# EAGLE schematic mainboard (EAGLE 6.4)
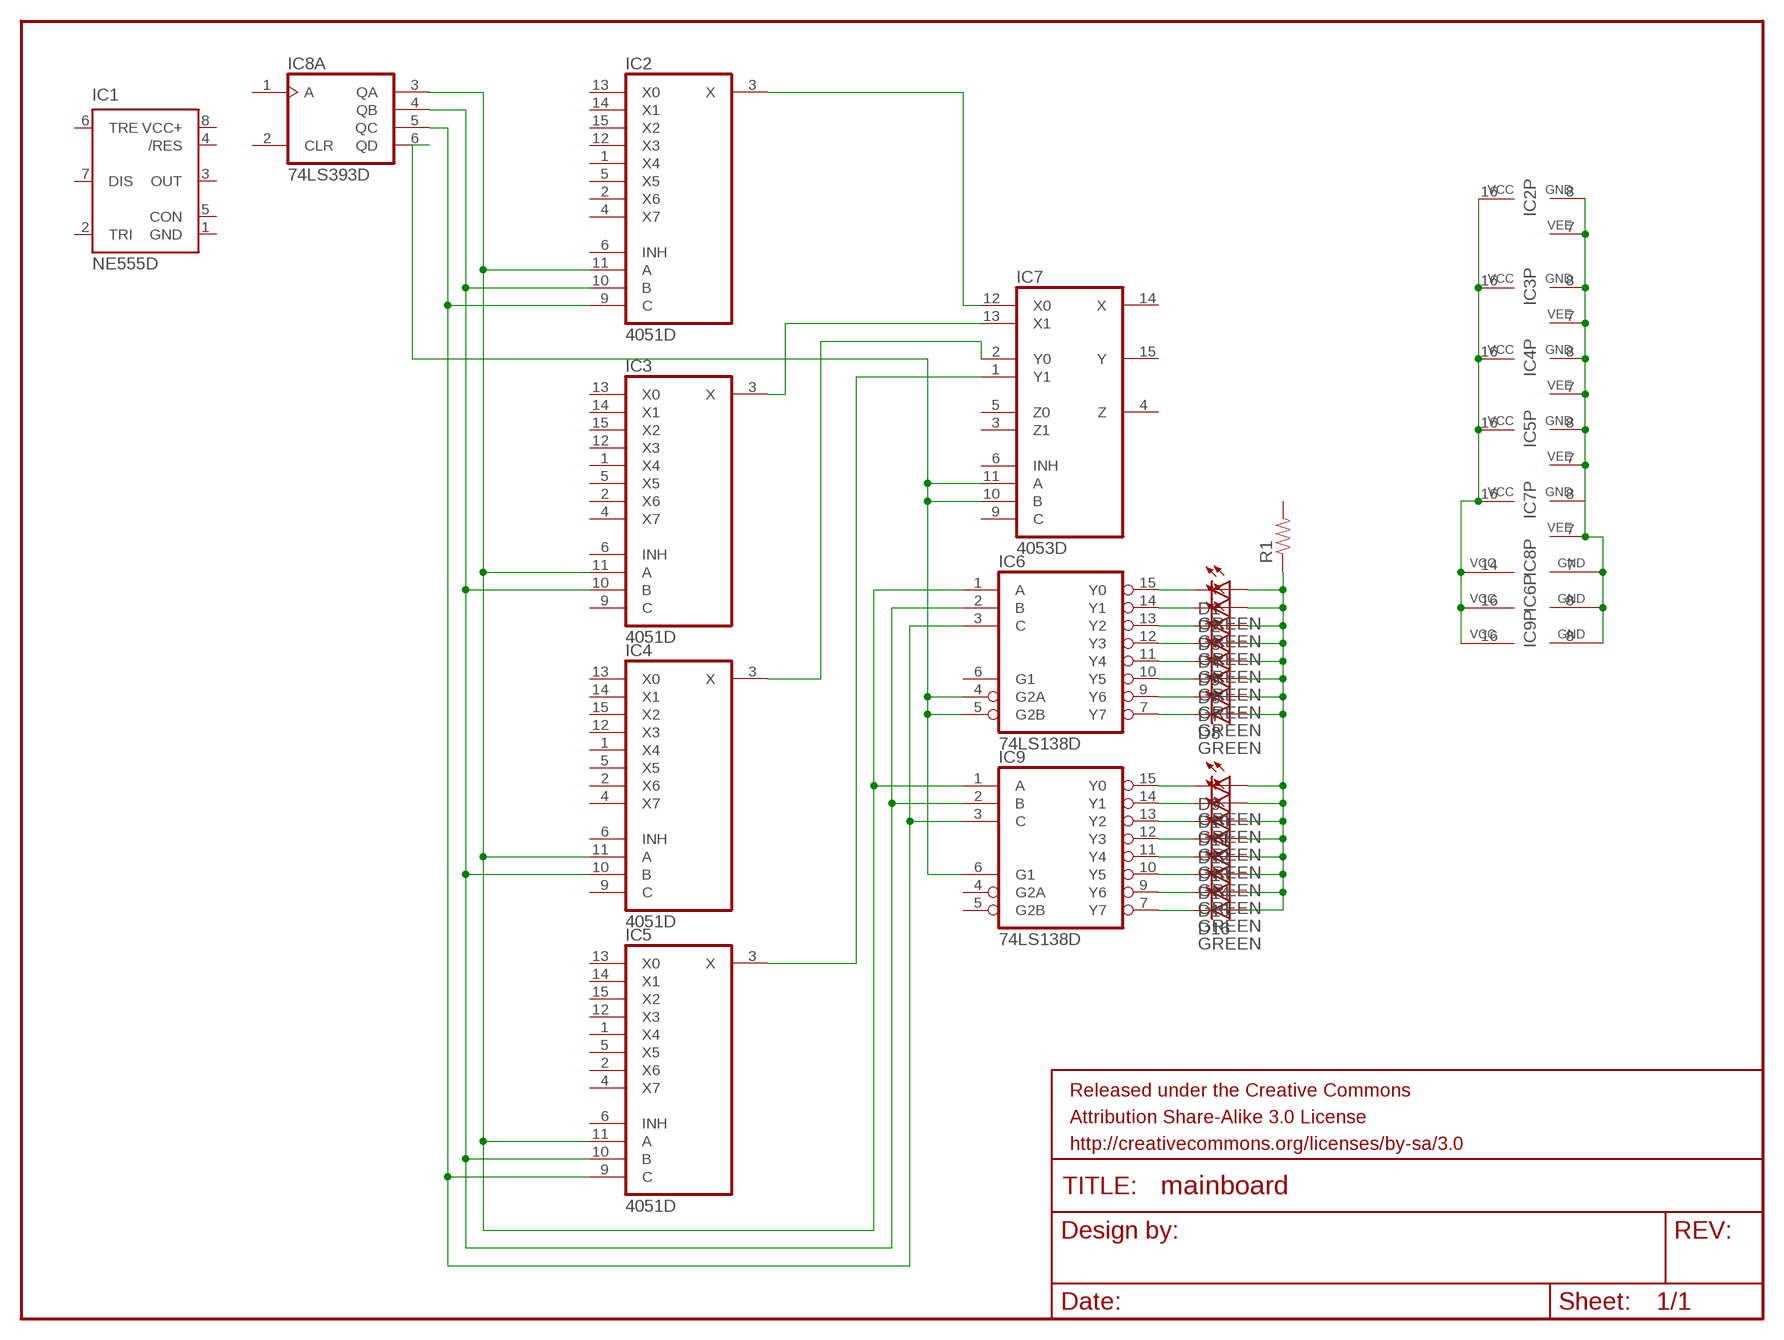
[diagram p0: schematic, sheet 1]

## Parts
D1  GREEN  LED-GREEN0603  [LED-0603]
D2  GREEN  LED-GREEN0603  [LED-0603]
D3  GREEN  LED-GREEN0603  [LED-0603]
D4  GREEN  LED-GREEN0603  [LED-0603]
D5  GREEN  LED-GREEN0603  [LED-0603]
D6  GREEN  LED-GREEN0603  [LED-0603]
D7  GREEN  LED-GREEN0603  [LED-0603]
D8  GREEN  LED-GREEN0603  [LED-0603]
D9  GREEN  LED-GREEN0603  [LED-0603]
D10  GREEN  LED-GREEN0603  [LED-0603]
D11  GREEN  LED-GREEN0603  [LED-0603]
D12  GREEN  LED-GREEN0603  [LED-0603]
D13  GREEN  LED-GREEN0603  [LED-0603]
D14  GREEN  LED-GREEN0603  [LED-0603]
D15  GREEN  LED-GREEN0603  [LED-0603]
D16  GREEN  LED-GREEN0603  [LED-0603]
FRAME1  FRAME-LETTER  [CREATIVE_COMMONS]
IC1  NE555D  [SO08]
IC2  4051D  [SO16]
IC3  4051D  [SO16]
IC4  4051D  [SO16]
IC5  4051D  [SO16]
IC6  74LS138D  [SO16]
IC7  4053D  [SO16]
IC8  74LS393D  [SO14]
IC9  74LS138D  [SO16]
R1  RESISTOR0603  [0603-RES]

## Nets
N$1: IC2.7(VEE) IC2.8(GND) IC3.7(VEE) IC3.8(GND) IC4.7(VEE) IC4.8(GND) IC5.7(VEE) IC5.8(GND) IC6.8(GND) IC7.7(VEE) IC8.7(P:GND) IC9.8(GND)
N$2: IC2.16(VCC) IC3.16(VCC) IC4.16(VCC) IC5.16(VCC) IC6.16(VCC) IC7.16(VCC) IC8.14(P:VCC) IC9.16(VCC)
N$3: IC2.11(A) IC3.11(A) IC4.11(A) IC5.11(A) IC6.1(A) IC8.3(A:QA) IC9.1(A)
N$4: IC2.10(B) IC3.10(B) IC4.10(B) IC5.10(B) IC6.2(B) IC8.4(A:QB) IC9.2(B)
N$5: IC2.9(C) IC5.9(C) IC6.3(C) IC8.5(A:QC) IC9.3(C)
N$6: IC6.4(G2A) IC6.5(G2B) IC7.10(B) IC7.11(A) IC8.6(A:QD) IC9.6(G1)
N$7: IC2.3(X) IC7.12(X0)
N$8: IC3.3(X) IC7.13(X1)
N$9: IC4.3(X) IC7.2(Y0)
N$10: IC5.3(X) IC7.1(Y1)
N$11: D1.C IC6.15(Y0)
N$12: D2.C IC6.14(Y1)
N$13: D3.C IC6.13(Y2)
N$14: D4.C IC6.12(Y3)
N$15: D5.C IC6.11(Y4)
N$16: D6.C IC6.10(Y5)
N$17: D7.C IC6.9(Y6)
N$18: D8.C IC6.7(Y7)
N$19: D9.C IC9.15(Y0)
N$20: D10.C IC9.14(Y1)
N$21: D11.C IC9.13(Y2)
N$22: D12.C IC9.12(Y3)
N$23: D13.C IC9.11(Y4)
N$24: D14.C IC9.10(Y5)
N$25: D15.C IC9.9(Y6)
N$26: D16.C IC9.7(Y7)
N$27: D1.A D2.A D3.A D4.A D5.A D6.A D7.A D8.A D9.A D10.A D11.A D12.A D13.A D14.A D15.A D16.A R1.1
Unconnected: IC1.2(TRI) IC1.3(OUT) IC1.4(/RES) IC1.5(CON) IC1.6(TRE) IC1.7(DIS) IC2.1(X4) IC2.2(X6) IC2.4(X7) IC2.5(X5) IC2.6(INH) IC2.12(X3) IC2.13(X0) IC2.14(X1) IC2.15(X2) IC3.1(X4) IC3.2(X6) IC3.4(X7) IC3.5(X5) IC3.6(INH) IC3.9(C) IC3.12(X3) IC3.13(X0) IC3.14(X1) IC3.15(X2) IC4.1(X4) IC4.2(X6) IC4.4(X7) IC4.5(X5) IC4.6(INH) IC4.9(C) IC4.12(X3) IC4.13(X0) IC4.14(X1) IC4.15(X2) IC5.1(X4) IC5.2(X6) IC5.4(X7) IC5.5(X5) IC5.6(INH) IC5.12(X3) IC5.13(X0) IC5.14(X1) IC5.15(X2) IC6.6(G1) IC7.3(Z1) IC7.4(Z) IC7.5(Z0) IC7.6(INH) IC7.9(C) IC7.14(X) IC7.15(Y) IC8.1(A:A) IC8.2(A:CLR) IC8.8(B:QD) IC8.9(B:QC) IC8.10(B:QB) IC8.11(B:QA) IC8.12(B:CLR) IC8.13(B:A) IC9.4(G2A) IC9.5(G2B) R1.2

## Power pins joined to a net without a drawn wire
GND: IC1.1(GND) IC7.8(GND)
VCC+: IC1.8(VCC+)

## Library data of the parts
D1-D16 = SparkFun-LED:LED-GREEN: Various green LEDs 0603- DIO-00821 LARGE- DIO-00862 LILYPAD- DIO-09910; PROD_ID: DIO-00821
FRAME1 = SparkFun-Aesthetics:FRAME-LETTER: Schematic Frame Standard 8.5x11 US Letter frame
IC1 = SparkFun-AnalogIC:NE555: General purpose bipolar Timer
IC2-IC5 = 40xx:4051: 8-channel ANALOG MULTIPLEXER
IC6 IC9 = 74xx-us:74*138: 3-line to 8-line DECODER/DEMULTIPLEXER
IC7 = 40xx:4053: Triple 2-channel ANALOG MULTIPLEXER
IC8 = 74xx-us:74*393: Dual 4-bit decade and binary COUNTER
R1 = SparkFun-Resistors:RESISTOR: Resistor Basic schematic elements and footprints for 0603, 1206, and PTH resistors.